# EAGLE design dfx-floppy (EAGLE 5.11)
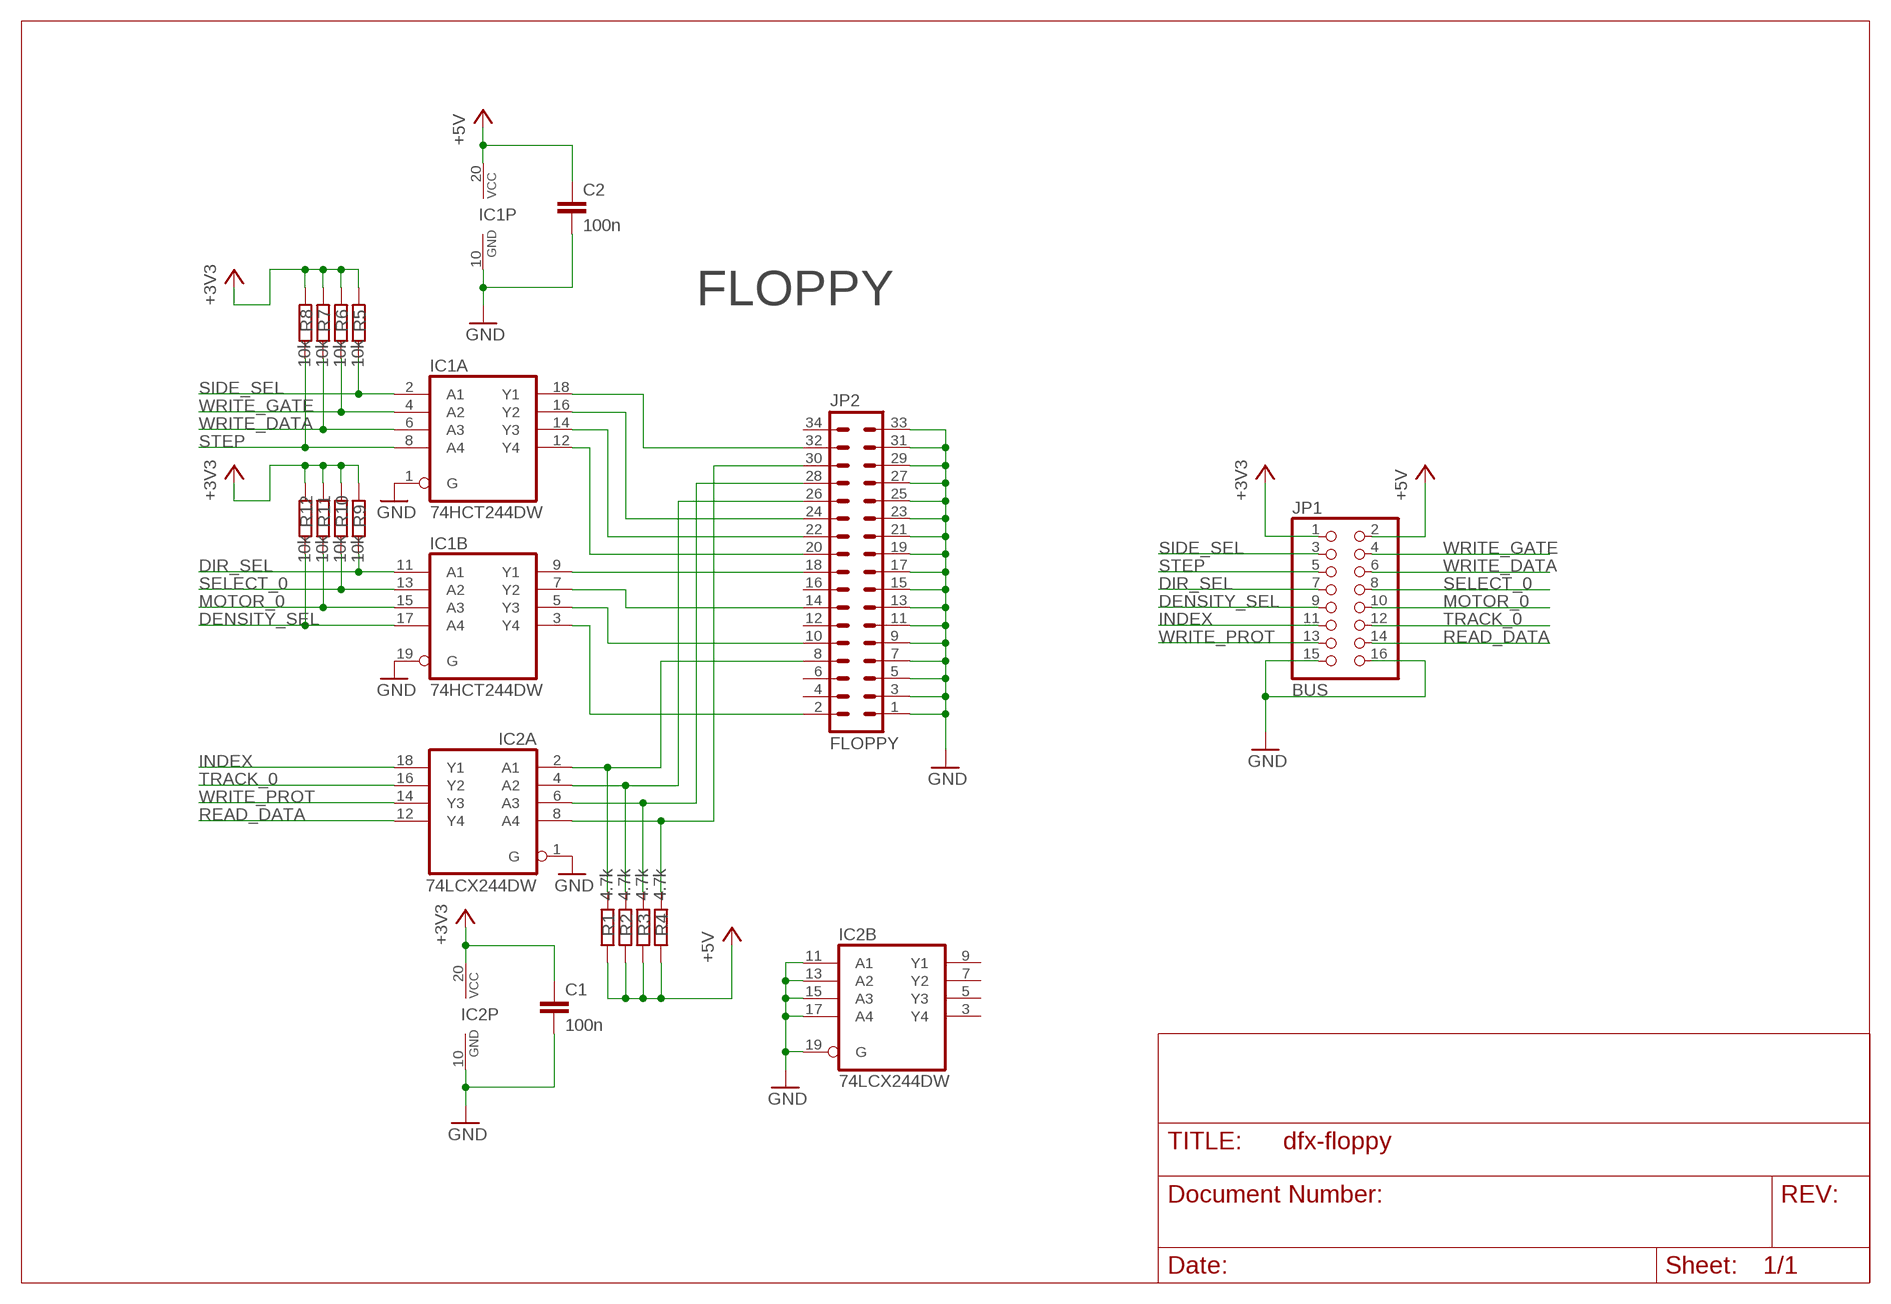
[diagram p0: schematic, sheet 1]

## Parts
C1  100n  C-EUC1210  [C1210]
C2  100n  C-EUC1210  [C1210]
IC1  74HCT244DW  [SO20W]
IC2  74LCX244DW  [SO20W]
JP1  BUS  PINHD-2X8  [2X08]
JP2  FLOPPY  ML34  [ML34]
R1  4.7k  R-EU_R0805  [R0805]
R2  4.7k  R-EU_R0805  [R0805]
R3  4.7k  R-EU_R0805  [R0805]
R4  4.7k  R-EU_R0805  [R0805]
R5  10k  R-EU_R0805  [R0805]
R6  10k  R-EU_R0805  [R0805]
R7  10k  R-EU_R0805  [R0805]
R8  10k  R-EU_R0805  [R0805]
R9  10k  R-EU_R0805  [R0805]
R10  10k  R-EU_R0805  [R0805]
R11  10k  R-EU_R0805  [R0805]
R12  10k  R-EU_R0805  [R0805]

## Nets
+3V3: C1.1 IC2.20(P:VCC) JP1.1 R5.2 R6.2 R7.2 R8.2 R9.2 R10.2 R11.2 R12.2
+5V: C2.1 IC1.20(P:VCC) JP1.2 R1.1 R2.1 R3.1 R4.1
DENSITY_SEL: IC1.17(B:A4) JP1.9 R12.1
DIR_SEL: IC1.11(B:A1) JP1.7 R9.1
GND: C1.2 C2.2 IC1.1(A:G) IC1.10(P:GND) IC1.19(B:G) IC2.1(A:G) IC2.10(P:GND) IC2.11(B:A1) IC2.13(B:A2) IC2.15(B:A3) IC2.17(B:A4) IC2.19(B:G) JP1.15 JP1.16 JP2.1 JP2.3 JP2.5 JP2.7 JP2.9 JP2.11 JP2.13 JP2.15 JP2.17 JP2.19 JP2.21 JP2.23 JP2.25 JP2.27 JP2.29 JP2.31 JP2.33
INDEX: IC2.18(A:Y1) JP1.11
MOTOR_0: IC1.15(B:A3) JP1.10 R11.1
N$1: IC2.2(A:A1) JP2.8 R1.2
N$2: IC2.4(A:A2) JP2.26 R2.2
N$3: IC2.6(A:A3) JP2.28 R3.2
N$4: IC2.8(A:A4) JP2.30 R4.2
N$8: IC1.3(B:Y4) JP2.2
N$9: IC1.5(B:Y3) JP2.10
N$10: IC1.7(B:Y2) JP2.14
N$11: IC1.9(B:Y1) JP2.18
N$12: IC1.12(A:Y4) JP2.20
N$13: IC1.14(A:Y3) JP2.22
N$14: IC1.16(A:Y2) JP2.24
N$15: IC1.18(A:Y1) JP2.32
READ_DATA: IC2.12(A:Y4) JP1.14
SELECT_0: IC1.13(B:A2) JP1.8 R10.1
SIDE_SEL: IC1.2(A:A1) JP1.3 R5.1
STEP: IC1.8(A:A4) JP1.5 R8.1
TRACK_0: IC2.16(A:Y2) JP1.12
WRITE_DATA: IC1.6(A:A3) JP1.6 R7.1
WRITE_GATE: IC1.4(A:A2) JP1.4 R6.1
WRITE_PROT: IC2.14(A:Y3) JP1.13
Unconnected: IC2.3(B:Y4) IC2.5(B:Y3) IC2.7(B:Y2) IC2.9(B:Y1) JP2.4 JP2.6 JP2.12 JP2.16 JP2.34

## Notes on the sheet
- FLOPPY

## Library data of the parts
C1 C2 = rcl:C-EU: CAPACITOR, European symbol
IC1 = 74xx-eu:74*244: Octal BUFFER and LINE DRIVER, 3-state
IC2 = cvlib:74*244: Octal BUFFER and LINE DRIVER, 3-state
JP1 = pinhead:PINHD-2X8: PIN HEADER
JP2 = con-ml:ML34: HARTING; OC_FARNELL: unknown; OC_NEWARK: unknown
R1-R12 = rcl:R-EU_: RESISTOR, European symbol

## Board
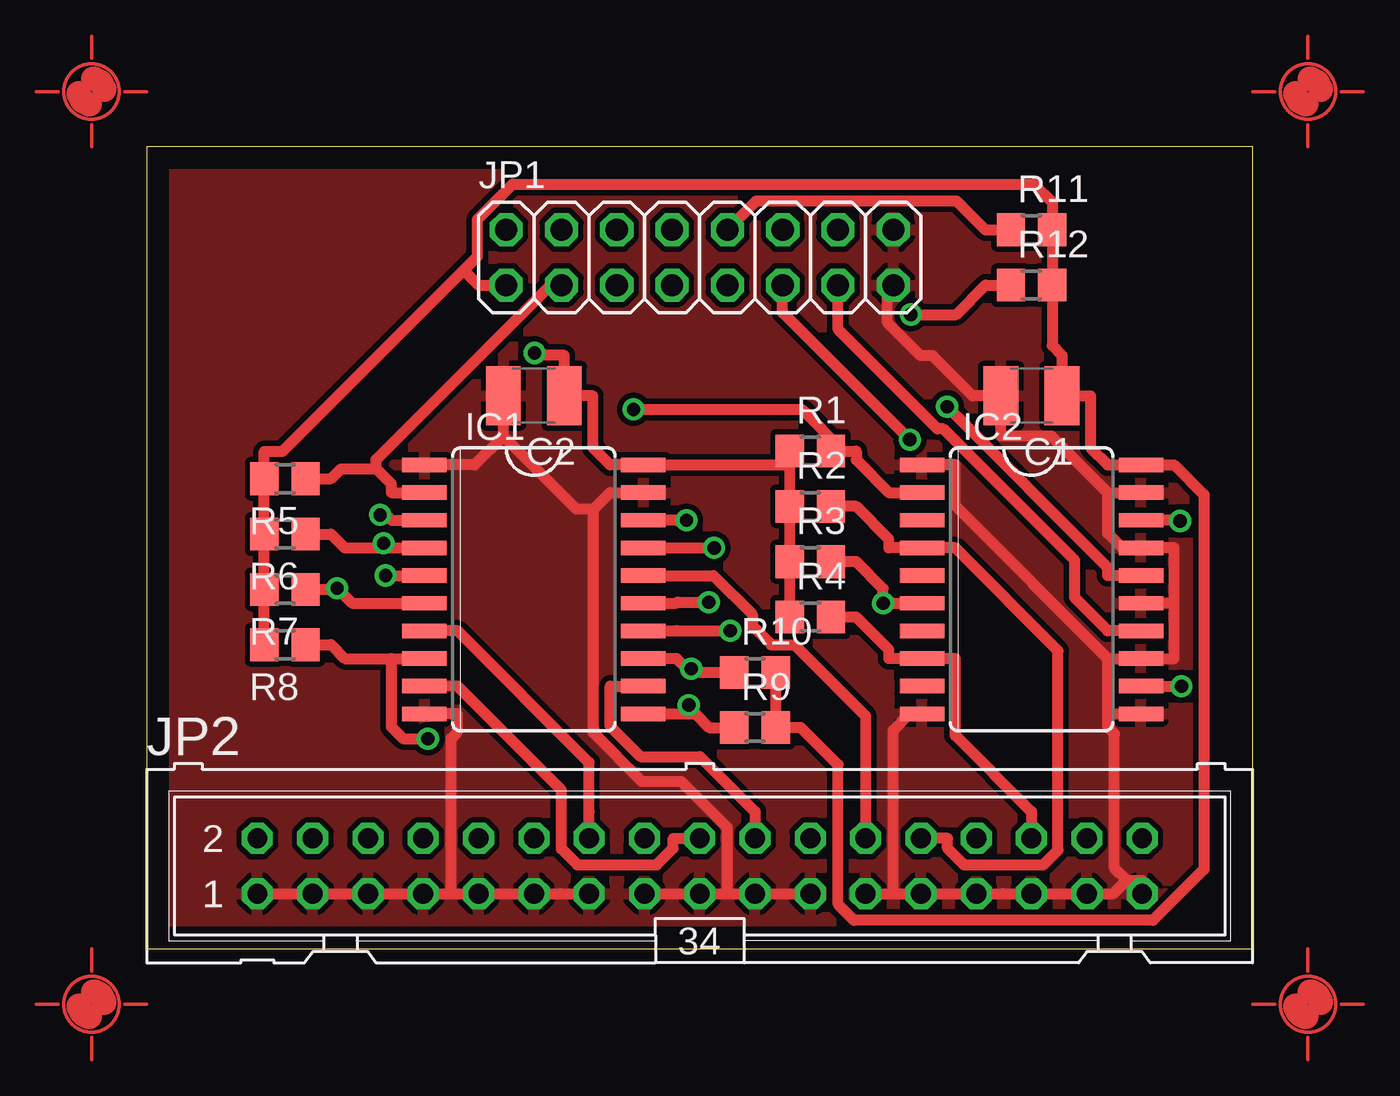
[diagram p1: board, top side]
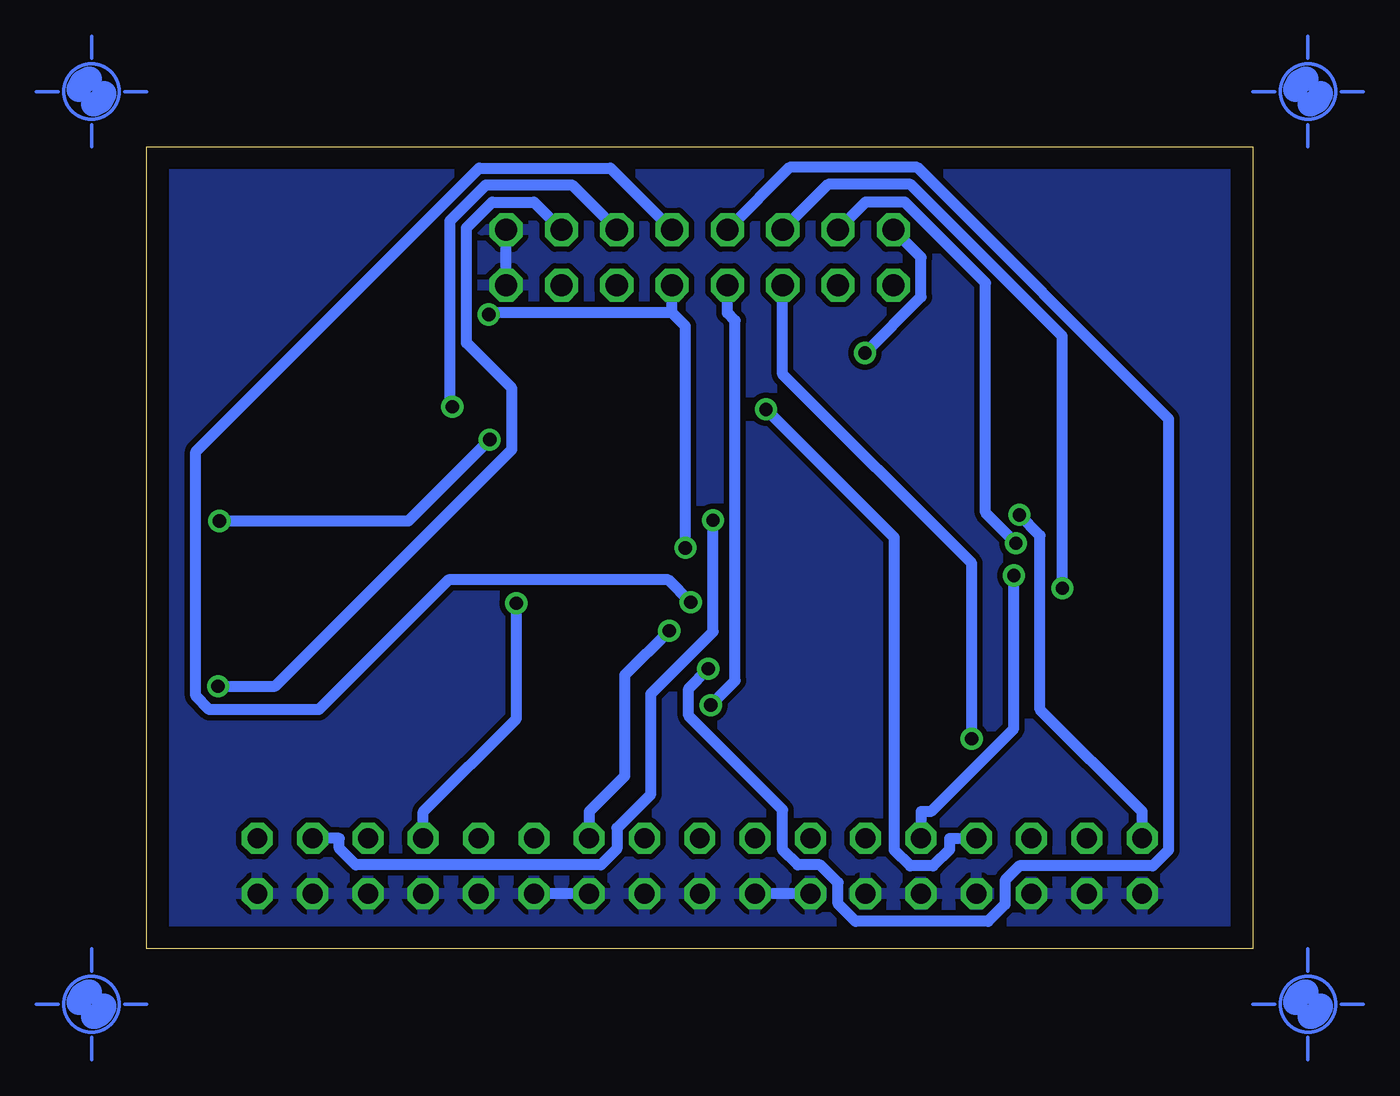
[diagram p2: board, bottom side, seen from below]

Size 50.8 x 36.83 mm. Coordinates in mm from the lower left corner, seen from the top.
Outline: 0,0 50.8,0 50.8,36.83 0,36.83 0,0
Copper layers (1*16): Top 0.035mm / dielectric 1.5mm / Bottom 0.035mm
Design rules "default *": minimum track width 20mil, minimum drill 24mil, track to track 10mil, track to pad 10mil, pad to pad 10mil, via to via 10mil, smd to smd 10mil, copper to edge 40mil, drill to drill 8mil, minimum pad ring 10mil, minimum via ring 8mil, stop-mask expansion 4mil, vias tented up to drill 0mil, thermal gap 10mil
vRestrict: area 14,10.2 to 21.6,24.1; area 36.8,10.2 to 44.5,24.1

### Footprints (pad centres in the part's own frame; a part is rotated, then mirrored left to right if it is on the bottom)
C1210 = smd 1.6 x 2.7: 1 -1.4,0; 2 1.4,0
SO20W = smd 0.66 x 2.032: 1 -5.715,-5.029; 2 -4.445,-5.029; 3 -3.175,-5.029; 4 -1.905,-5.029; 5 -0.635,-5.029; 6 0.635,-5.029; 7 1.905,-5.029; 8 3.175,-5.029; 9 4.445,-5.029; 10 5.715,-5.029; 11 5.715,5.029; 12 4.445,5.029; 13 3.175,5.029; 14 1.905,5.029; 15 0.635,5.029; 16 -0.635,5.029; 17 -1.905,5.029; 18 -3.175,5.029; 19 -4.445,5.029; 20 -5.715,5.029
2X08 = drill 1.016 octagon: 1 -8.89,-1.27; 2 -8.89,1.27; 3 -6.35,-1.27; 4 -6.35,1.27; 5 -3.81,-1.27; 6 -3.81,1.27; 7 -1.27,-1.27; 8 -1.27,1.27; 9 1.27,-1.27; 10 1.27,1.27; 11 3.81,-1.27; 12 3.81,1.27; 13 6.35,-1.27; 14 6.35,1.27; 15 8.89,-1.27; 16 8.89,1.27
ML34 = drill 0.914 octagon: 1 -20.32,-1.27; 2 -20.32,1.27; 3 -17.78,-1.27; 4 -17.78,1.27; 5 -15.24,-1.27; 6 -15.24,1.27; 7 -12.7,-1.27; 8 -12.7,1.27; 9 -10.16,-1.27; 10 -10.16,1.27; 11 -7.62,-1.27; 12 -7.62,1.27; 13 -5.08,-1.27; 14 -5.08,1.27; 15 -2.54,-1.27; 16 -2.54,1.27; 17 0,-1.27; 18 0,1.27; 19 2.54,-1.27; 20 2.54,1.27; 21 5.08,-1.27; 22 5.08,1.27; 23 7.62,-1.27; 24 7.62,1.27; 25 10.16,-1.27; 26 10.16,1.27; 27 12.7,-1.27; 28 12.7,1.27; 29 15.24,-1.27; 30 15.24,1.27; 31 17.78,-1.27; 32 17.78,1.27; 33 20.32,-1.27; 34 20.32,1.27
R0805 = smd 1.3 x 1.5: 1 -0.95,0; 2 0.95,0

### Placement (x,y rotation side)
C1  40.64,25.4 180 top
C2  17.78,25.4 180 top
IC1  17.78,16.51 270 top
IC2  40.64,16.51 270 top
JP1  25.4,31.75 0 top
JP2  25.4,3.81 0 top
R1  30.48,22.86 0 top
R2  30.48,20.32 0 top
R3  30.48,17.78 0 top
R4  30.48,15.24 0 top
R5  6.35,21.59 180 top
R6  6.35,19.05 180 top
R7  6.35,16.51 180 top
R8  6.35,13.97 180 top
R9  27.94,10.16 0 top
R10  27.94,12.7 0 top
R11  40.64,33.02 0 top
R12  40.64,30.48 0 top
U$2  [PASS-ROUND]  53.34,39.37 0 top
U$3  [PASS-ROUND]  -2.54,39.37 0 top
U$4  [PASS-ROUND]  -2.54,-2.54 0 top
U$5  [PASS-ROUND]  53.34,-2.54 0 top

### Tracks (layer width: path | path; a pad name or v marks a point on that pad's centre or on a via)
+3V3
  Top 0.508: 14.55,31.17 6.24,22.85 5.4,22.85 R5.2 R6.2 R7.2 R8.2 | 14.55,31.17 15.19,31.8 15.19,33.5 16.81,35.12 40.75,35.12 41.59,34.28 R11.2 R12.2 41.59,27.71 42.04,27.26 C1.1 43.35,25.4 43.35,23.02 44.15,22.23 44.91,22.23 IC2.20 47.19,22.23 48.56,20.86 48.56,3.65 46.22,1.31 32.49,1.31 31.75,2.05 31.75,8.46 30.05,10.16 R9.2 28.89,11.42 28.89,11.44 R10.2 | 14.55,31.17 15.24,30.48 JP1.1
+5V  (via drill 0.61 pad 1.02)
  Top 0.508: 29.53,22.23 R1.1 | 29.53,22.23 R2.1 R3.1 R4.1 | 29.53,22.23 24.33,22.23 IC1.20 21.29,22.23 20.49,23.02 20.49,25.4 C2.1 19.18,27.26 17.92,27.26 v17.82,27.36
  Bottom 0.508: JP1.2 15.24,31.75 15.24,29.94 v17.82,27.36
DENSITY_SEL  (via drill 0.61 pad 1.02)
  Top 0.508: v26.06,18.41 24.33,18.41 IC1.17 | R12.1 38.53,30.48 37.18,29.13 v35.09,29.13
  Bottom 0.508: 26.67,29.21 26.06,28.6 v26.06,18.41 | v35.09,29.13 35.01,29.21 26.67,29.21 | 26.67,29.21 JP1.9
DIR_SEL  (via drill 0.61 pad 1.02)
  Top 0.508: 24.9,10.79 24.33,10.79 IC1.11 | 24.9,10.79 25.2,10.79 25.83,10.16 R9.1 | 24.9,10.79 v24.9,11.2
  Bottom 0.508: v24.9,11.2 23.77,12.32 23.77,28.85 24.13,29.21 JP1.7
GND
  Top 0.508: 20.52,20.19 19.73,20.19 16.38,23.54 | 20.52,20.19 21.29,20.95 IC1.19 | 26.67,2.54 26.67,5.57 24.55,7.69 22.75,7.69 20.52,9.92 20.52,20.19 | IC1.1 15.06,22.23 16.38,23.54 | 26.67,2.54 JP2.17 JP2.15 | 26.67,2.54 JP2.19 JP2.21 | 16.38,23.54 C2.2 | IC1.10 14.28,10.79 14.28,9.96 13.97,9.65 13.97,2.54 | 13.97,2.54 JP2.7 JP2.5 JP2.3 JP2.1 | 13.97,2.54 JP2.9 JP2.11 17.95,2.54 19,2.54 JP2.13 | JP1.15 34.03,30.22 34.03,28.75 35.54,27.24 36.09,27.24 37.93,25.4 C1.2 39.24,23.54 41.56,23.54 44.15,20.95 | IC2.1 37.13,22.23 37.13,20.34 44.15,13.34 | 44.15,13.34 44.34,13.34 IC2.13 47.19,13.34 47.19,15.88 | 44.15,10.79 44.15,13.34 | 45.01,3.15 44.45,3.71 44.45,9.88 44.15,10.19 44.15,10.79 | 47.19,15.88 47.19,18.41 IC2.17 44.81,18.41 44.15,19.08 44.15,20.95 | 47.19,15.88 IC2.15 | 45.01,3.15 44.4,2.54 JP2.31 JP2.29 39.32,2.54 JP2.27 JP2.25 34.29,2.54 | 45.01,3.15 45.72,3.15 JP2.33 | 44.15,10.79 IC2.11 | 44.15,20.95 IC2.19 | JP2.23 34.29,2.54 | 34.29,2.54 34.29,10.05 35.04,10.79 IC2.10
  Bottom 0.508: JP2.13 JP2.15 | JP2.21 JP2.23 | JP1.15 JP1.16
  pour Bottom: 0,36.83 50.8,36.83 50.8,0 0,0
  pour Top: 0,36.83 50.8,36.83 50.8,0 0,0
INDEX  (via drill 0.61 pad 1.02)
  Top 0.508: JP1.11 29.21,29.21 29.23,29.21 v35.05,23.39 | v47.47,19.65 47.23,19.65 47.19,19.68 IC2.18
  Bottom 0.508: v35.05,23.39 38.79,19.65 v47.47,19.65
MOTOR_0  (via drill 0.61 pad 1.02)
  Top 0.508: JP1.10 28,34.35 37.2,34.35 38.53,33.02 R11.1 | IC1.15 24.33,15.88 24.38,15.92 v25.82,15.92
  Bottom 0.508: JP1.10 29.5,35.85 35.53,35.85 48.55,22.84 48.55,11.61 47.92,10.99 42.9,10.99 36.95,16.95 26.84,16.95 v25.82,15.92
N$1  (via drill 0.61 pad 1.02)
  Top 0.508: 32.01,22.86 30.09,24.77 v22.35,24.77 | 32.01,22.86 32.59,22.86 32.59,22.45 34.09,20.95 IC2.2 | 32.01,22.86 R1.2
  Bottom 0.508: JP2.8 13.92,5.08 13.92,4.58 14.68,3.81 15.73,3.81 16.46,4.54 16.46,18.88 v22.35,24.77
N$2
  Top 0.508: JP2.26 36.78,5.08 36.78,4.62 37.54,3.86 41.18,3.86 41.86,4.54 41.86,13.69 37.13,18.41 IC2.4 34.09,18.41 34.09,18.82 32.59,20.32 R2.2
N$3  (via drill 0.61 pad 1.02)
  Top 0.508: IC2.6 34.28,15.88 v33.83,15.88 33.83,16.54 32.59,17.78 R3.2
  Bottom 0.508: v33.83,15.88 33.83,10.57 38.1,6.3 JP2.28
N$4
  Top 0.508: R4.2 32.59,15.24 34.09,13.74 34.09,13.34 IC2.8 37.13,13.34 37.13,9.8 40.64,6.3 JP2.30
N$8  (via drill 0.61 pad 1.02)
  Top 0.508: v10.72,19.93 10.98,19.93 11.23,19.68 IC1.3
  Bottom 0.508: v10.72,19.93 9.77,18.97 9.77,10.98 5.08,6.3 JP2.2
N$9  (via drill 0.61 pad 1.02)
  Top 0.508: v10.97,17.14 11.23,17.14 IC1.5
  Bottom 0.508: v10.97,17.14 10.97,10.11 14.78,6.3 15.24,6.3 JP2.10
N$10
  Top 0.508: JP2.14 20.32,6.3 20.32,8.56 14.28,14.61 IC1.7
N$11
  Top 0.508: IC1.9 14.28,12.06 19.05,7.29 19.05,4.59 19.78,3.86 23.42,3.86 24.18,4.62 24.18,5.08 JP2.18
N$12
  Top 0.508: IC1.12 21.29,12.06 21.29,10.23 22.68,8.83 25.41,8.83 27.94,6.3 JP2.20
N$13  (via drill 0.61 pad 1.02)
  Top 0.508: IC1.14 24.33,14.61 24.34,14.61 v26.8,14.61
  Bottom 0.508: 28.84,12.57 28.84,7.93 30.48,6.3 JP2.22 | 28.84,12.57 | v26.8,14.61 28.84,12.57
N$14
  Top 0.508: JP2.24 33.02,10.7 29.76,13.96 28.69,13.96 27.82,14.83 27.82,15.36 26.03,17.14 IC1.16
N$15  (via drill 0.61 pad 1.02)
  Top 0.508: v24.79,19.68 24.34,19.68 24.33,19.68 IC1.18
  Bottom 0.508: v24.79,19.68 24.79,14.57 27.65,11.71 27.65,7.11 29.21,5.55 29.21,4.59 29.94,3.86 41.2,3.86 41.96,4.62 41.96,5.08 JP2.32
READ_DATA  (via drill 0.61 pad 1.02)
  Top 0.508: IC2.12 v47.53,12.06
  Bottom 0.508: JP1.14 33.02,34.29 34.93,34.29 36.12,33.11 36.12,27.83 34.03,25.74 34.03,22.94 44.9,12.06 v47.53,12.06
SELECT_0  (via drill 0.61 pad 1.02)
  Top 0.508: R10.1 25.83,12.7 25.17,12.7 v25.01,12.86 24.81,12.86 24.33,13.34 IC1.13
  Bottom 0.508: v25.01,12.86 25.91,11.96 25.91,10.71 21.59,6.39 21.59,4.55 20.9,3.86 19.87,3.86 19.05,3.04 19.05,2.07 18.25,1.27 12.16,1.27 11.38,2.05 11.38,3.15 10.72,3.81 4.59,3.81 3.86,4.54 3.86,24.33 15.41,35.88 21.27,35.88 JP1.8
SIDE_SEL
  Top 0.508: 10.53,22.05 11.23,21.35 11.23,20.95 IC1.2 | 10.53,22.05 8.92,22.05 8.46,21.59 R5.1 | JP1.3 18.55,30.48 10.53,22.46 10.53,22.05
STEP  (via drill 0.61 pad 1.02)
  Top 0.508: 11.23,13.34 11.23,10.2 11.77,9.65 v12.91,9.65 | 11.23,13.34 IC1.8 | 11.23,13.34 9.09,13.34 8.46,13.97 R8.1
  Bottom 0.508: JP1.5 21.59,26.38 12.91,17.7 v12.91,9.65
TRACK_0  (via drill 0.61 pad 1.02)
  Top 0.508: v36.77,24.89 44.15,17.51 44.15,17.14 IC2.16
  Bottom 0.508: JP1.12 31.28,35.09 35.22,35.09 36.88,33.42 36.88,25.01 v36.77,24.89
WRITE_DATA  (via drill 0.61 pad 1.02)
  Top 0.508: IC1.6 9.43,15.88 v8.75,16.56 8.7,16.51 8.46,16.51 R7.1
  Bottom 0.508: JP1.6 19.5,35.11 15.72,35.11 8.75,28.14 v8.75,16.56
WRITE_GATE  (via drill 0.61 pad 1.02)
  Top 0.508: v10.88,18.63 11.01,18.63 11.23,18.41 | 11.23,18.41 9.09,18.41 8.46,19.05 R6.1 | 11.23,18.41 IC1.4
  Bottom 0.508: JP1.4 17.78,34.29 15.98,34.29 12.28,30.59 12.28,20.03 v10.88,18.63
WRITE_PROT
  Top 0.508: IC2.14 44.15,14.61 42.62,16.13 42.62,17.84 36.58,23.87 36.33,23.87 31.75,28.45 JP1.13